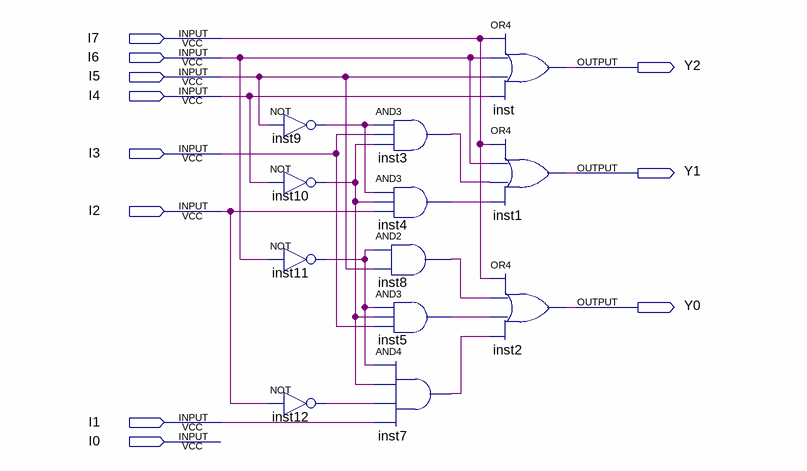
[diagram p0: schematic sheet]
// Quartus schematic 8x3_encoder_P.bdf as structural Verilog: 12 symbols, 11 pins
module \8x3_encoder_P  (
  input  I7,
  input  I6,
  input  I5,
  input  I4,
  input  I3,
  input  I2,
  input  I1,
  input  I0,
  output Y2,
  output Y1,
  output Y0
);

  wire inst3_out, inst4_out, inst5_out, inst7_out, inst8_out, inst9_out, inst10_out, inst11_out, inst12_out;

  not inst9 (inst9_out, I5);
  not inst10 (inst10_out, I4);
  not inst11 (inst11_out, I6);
  not inst12 (inst12_out, I2);
  and inst3 (inst3_out, inst9_out, I3, inst10_out);
  and inst4 (inst4_out, inst9_out, inst10_out, I2);
  and inst8 (inst8_out, inst11_out, I5);
  and inst5 (inst5_out, inst11_out, inst10_out, I3);
  and inst7 (inst7_out, inst11_out, inst10_out, inst12_out, I1);
  or inst (Y2, I7, I6, I5, I4);
  or inst1 (Y1, I7, I6, inst3_out, inst4_out);
  or inst2 (Y0, I7, inst8_out, inst5_out, inst7_out);
endmodule
